# EAGLE design RPi-GPIO-V4 (EAGLE 6.4)
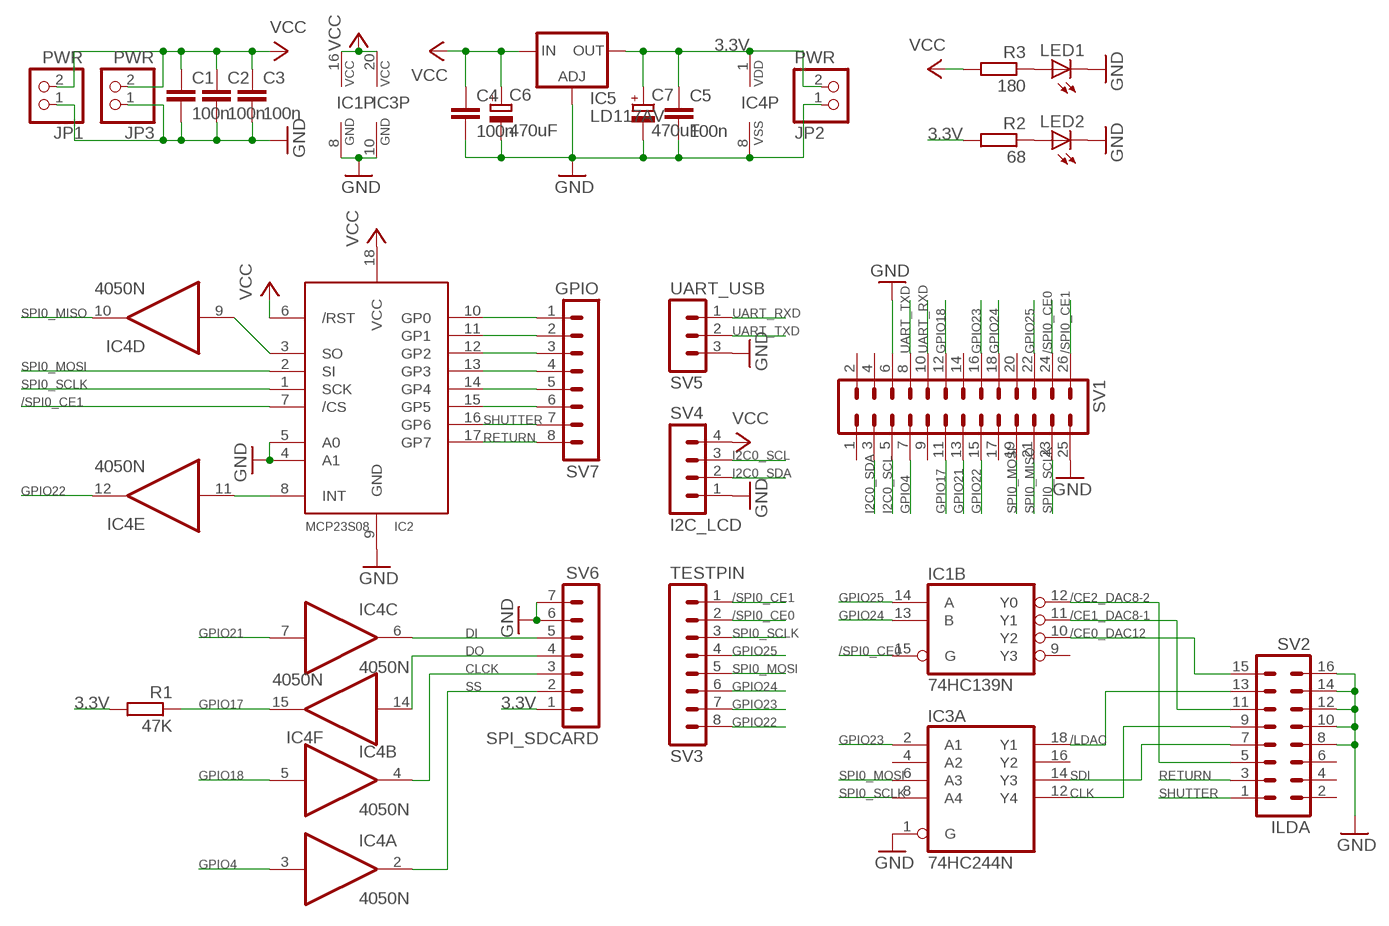
[diagram p0: schematic, sheet 1]

## Parts
C1  100n  C-EU050-024X044  [C050-024X044]
C2  100n  C-EU050-024X044  [C050-024X044]
C3  100n  C-EU050-024X044  [C050-024X044]
C4  100n  C-EU050-024X044  [C050-024X044]
C5  100n  C-EU050-024X044  [C050-024X044]
C6  470uF  CPOL-EUE5-8.5  [E5-8,5]
C7  470uF  CPOL-EUE5-8.5  [E5-8,5]
IC1  74HC139N  [DIL16]
IC2  MCP2300X/P  [DIL18]
IC3  74HC244N  [DIL20]
IC4  4050N  [DIL16]
IC5  LD117AV  [TO220L1]
JP1  PWR  PINHD-1X2  [1X02]
JP2  PWR  PINHD-1X2  [1X02]
JP3  PWR  PINHD-1X2  [1X02]
LED1  LED3MM  [LED3MM]
LED2  LED3MM  [LED3MM]
R1  47K  R-EU_0204/5  [0204/5]
R2  68  R-EU_0204/5  [0204/5]
R3  180  R-EU_0204/5  [0204/5]
SV1  MA13-2  [MA13-2]
SV2  ILDA  MA08-2  [MA08-2]
SV3  TESTPIN  MA08-1  [MA08-1]
SV4  I2C_LCD  MA04-1  [MA04-1]
SV5  UART_USB  MA03-1  [MA03-1]
SV6  SPI_SDCARD  MA07-1  [MA07-1]
SV7  GPIO  MA08-1  [MA08-1]

## Nets
3.3V: C5.1 C7.+ IC4.1(P:VDD) IC5.2(OUT) JP2.2 R1.2 R2.2 SV6.1
/CE0_DAC12: IC1.10(B:Y2) SV2.15
/CE1_DAC8-1: IC1.11(B:Y1) SV2.11
/CE2_DAC8-2: IC1.12(B:Y0) SV2.5
/LDAC: IC3.18(A:Y1) SV2.13
/SPI0_CE0: IC1.15(B:G) SV1.24 SV3.2
/SPI0_CE1: IC2.7(/CS) SV1.26 SV3.1
CLCK: IC4.4(B:O) SV6.3
CLK: IC3.12(A:Y4) SV2.9
DI: IC4.6(C:O) SV6.5
DO: IC4.14(F:I) SV6.4
GND: C1.2 C2.2 C3.2 C4.2 C5.2 C6.- C7.- IC1.8(P:GND) IC2.4(A1) IC2.5(A0) IC2.9(GND) IC3.1(A:G) IC3.10(P:GND) IC4.8(P:VSS) IC5.1(ADJ) JP1.1 JP2.1 JP3.1 LED1.K(C) LED2.K(C) SV1.6 SV1.25 SV2.8 SV2.10 SV2.12 SV2.14 SV2.16 SV4.1 SV5.3 SV6.6 SV6.7
GPIO4: IC4.3(A:I) SV1.7
GPIO17: IC4.15(F:O) R1.1 SV1.11
GPIO18: IC4.5(B:I) SV1.12
GPIO21: IC4.7(C:I) SV1.13
GPIO22: IC4.12(E:O) SV1.15 SV3.8
GPIO23: IC3.2(A:A1) SV1.16 SV3.7
GPIO24: IC1.13(B:B) SV1.18 SV3.6
GPIO25: IC1.14(B:A) SV1.22 SV3.4
I2C0_SCL: SV1.5 SV4.3
I2C0_SDA: SV1.3 SV4.2
N$1: LED1.A R3.1
N$3: LED2.A R2.1
N$7: IC2.3(SO) IC4.9(D:I)
N$13: IC2.10(GP0) SV7.1
N$14: IC2.11(GP1) SV7.2
N$15: IC2.12(GP2) SV7.3
N$16: IC2.13(GP3) SV7.4
N$17: IC2.14(GP4) SV7.5
N$18: IC2.15(GP5) SV7.6
N$19: IC2.8(INT) IC4.11(E:I)
RETURN: IC2.17(GP7) SV2.3 SV7.8
SDI: IC3.14(A:Y3) SV2.7
SHUTTER: IC2.16(GP6) SV2.1 SV7.7
SPI0_MISO: IC4.10(D:O) SV1.21
SPI0_MOSI: IC2.2(SI) IC3.6(A:A3) SV1.19 SV3.5
SPI0_SCLK: IC2.1(SCK) IC3.8(A:A4) SV1.23 SV3.3
SS: IC4.2(A:O) SV6.2
UART_RXD: SV1.10 SV5.1
UART_TXD: SV1.8 SV5.2
VCC: C1.1 C2.1 C3.1 C4.1 C6.+ IC1.16(P:VCC) IC2.6(/RST) IC2.18(VCC) IC3.20(P:VCC) IC5.3(IN) JP1.2 JP3.2 R3.2 SV4.4
Unconnected: IC1.1(A:G) IC1.2(A:A) IC1.3(A:B) IC1.4(A:Y0) IC1.5(A:Y1) IC1.6(A:Y2) IC1.7(A:Y3) IC1.9(B:Y3) IC3.3(B:Y4) IC3.4(A:A2) IC3.5(B:Y3) IC3.7(B:Y2) IC3.9(B:Y1) IC3.11(B:A1) IC3.13(B:A2) IC3.15(B:A3) IC3.16(A:Y2) IC3.17(B:A4) IC3.19(B:G) SV1.1 SV1.2 SV1.4 SV1.9 SV1.14 SV1.17 SV1.20 SV2.2 SV2.4 SV2.6

## Library data of the parts
C1-C5 = rcl:C-EU: CAPACITOR, European symbol
C6 C7 = rcl:CPOL-EU: POLARIZED CAPACITOR, European symbol
IC1 = 74xx-eu:74*139: Dual 2-line to 4-line DECODER/DEMULTIPLEXER
IC2 = adafruit:MCP2300X: MCP23S08 Inexpensive SPI i/o expander - 8 general purpose i/o pins with optional pullups
IC3 = 74xx-eu:74*244: Octal BUFFER and LINE DRIVER, 3-state
IC4 = 40xx:4050: Hex non-inverting BUFFER
IC5 = v-reg:LD117A?*: Low drop fixed and adjustable positive voltage regulators 1 A Source: http://www.st.com/stonline/products/literature/ds/7194/ld1117axx.pdf
JP1-JP3 = pinhead:PINHD-1X2: PIN HEADER
LED1 LED2 = led:LED: LED OSRAM: - CHIPLED LG R971, LG N971, LY N971, LG Q971, LY Q971, LO R971, LY R971 LH N974, LH R974 LS Q976, LO Q976, LY Q976 LO Q996 - Hyper CHIPLED LW Q18S LB Q993, LB Q99A, LB R99A - SideLED LS A670, LO A670, LY A670, LG A670, LP A670 LB A673, LV A673, LT A673, LW A673 LH A674 LY A675 LS A676, LA A676, LO A676, LY A676, LW A676 LS A679, LY A679, LG A679 - Hyper Micro SIDELED® LS Y876, LA Y876, LO Y876, LY Y876 LT Y87S - SmartLED LW L88C, LW L88S LB L89C, LB L89S, LG L890 LS L89K, LO L89K, LY L89K LS L896, LA L896, LO L896, LY L896 - TOPLED LS T670, LO T670, LY T670, LG T670, LP T670 LSG T670, LSP T670, LSY T670, LOP T670, LYG T670 LG T671, LOG T671, LSG T671 LB T673, LV T673, LT T673, LW T673 LH T674 LS T676, LA T676, LO T676, LY T676, LB T676, LH T676, LSB T676, LW T676 LB T67C, LV T67C, LT T67C, LS T67K, LO T67K, LY T67K, LW E67C LS E67B, LA E67B, LO E67B, LY E67B, LB E67C, LV E67C, LT E67C LW T67C LS T679, LY T679, LG T679 LS T770, LO T770, LY T770, LG T770, LP T770 LB T773, LV T773, LT T773, LW T773 LH T774 LS E675, LA E675, LY E675, LS T675 LS T776, LA T776, LO T776, LY T776, LB T776 LHGB T686 LT T68C, LB T68C - Hyper Mini TOPLED® LB M676 - Mini TOPLED Santana® LG M470 LS M47K, LO M47K, LY M47K Source: http://www.osram.convergy.de LUXEON: - LUMILED® LXK2-PW12-R00, LXK2-PW12-S00, LXK2-PW14-U00, LXK2-PW14-V00 LXK2-PM12-R00, LXK2-PM12-S00, LXK2-PM14-U00 LXK2-PE12-Q00, LXK2-PE12-R00, LXK2-PE12-S00, LXK2-PE14-T00, LXK2-PE14-U00 LXK2-PB12-K00, LXK2-PB12-L00, LXK2-PB12-M00, LXK2-PB14-N00, LXK2-PB14-P00, LXK2-PB14-Q00 LXK2-PR12-L00, LXK2-PR12-M00, LXK2-PR14-Q00, LXK2-PR14-R00 LXK2-PD12-Q00, LXK2-PD12-R00, LXK2-PD12-S00 LXK2-PH12-R00, LXK2-PH12-S00 LXK2-PL12-P00, LXK2-PL12-Q00, LXK2-PL12-R00 Source: www.luxeon.com KINGBRIGHT: KA-3528ASYC Source: www.kingbright.com
R1-R3 = resistor:R-EU_: RESISTOR, European symbol
SV1 = con-lstb:MA13-2: PIN HEADER; OC_FARNELL: unknown; OC_NEWARK: unknown
SV2 = con-lstb:MA08-2: PIN HEADER; OC_FARNELL: unknown; OC_NEWARK: unknown
SV3 SV7 = con-lstb:MA08-1: PIN HEADER; OC_FARNELL: unknown; OC_NEWARK: unknown
SV4 = con-lstb:MA04-1: PIN HEADER; OC_FARNELL: unknown; OC_NEWARK: unknown
SV5 = con-lstb:MA03-1: PIN HEADER; OC_FARNELL: unknown; OC_NEWARK: unknown
SV6 = con-lstb:MA07-1: PIN HEADER; OC_FARNELL: unknown; OC_NEWARK: unknown

## Board
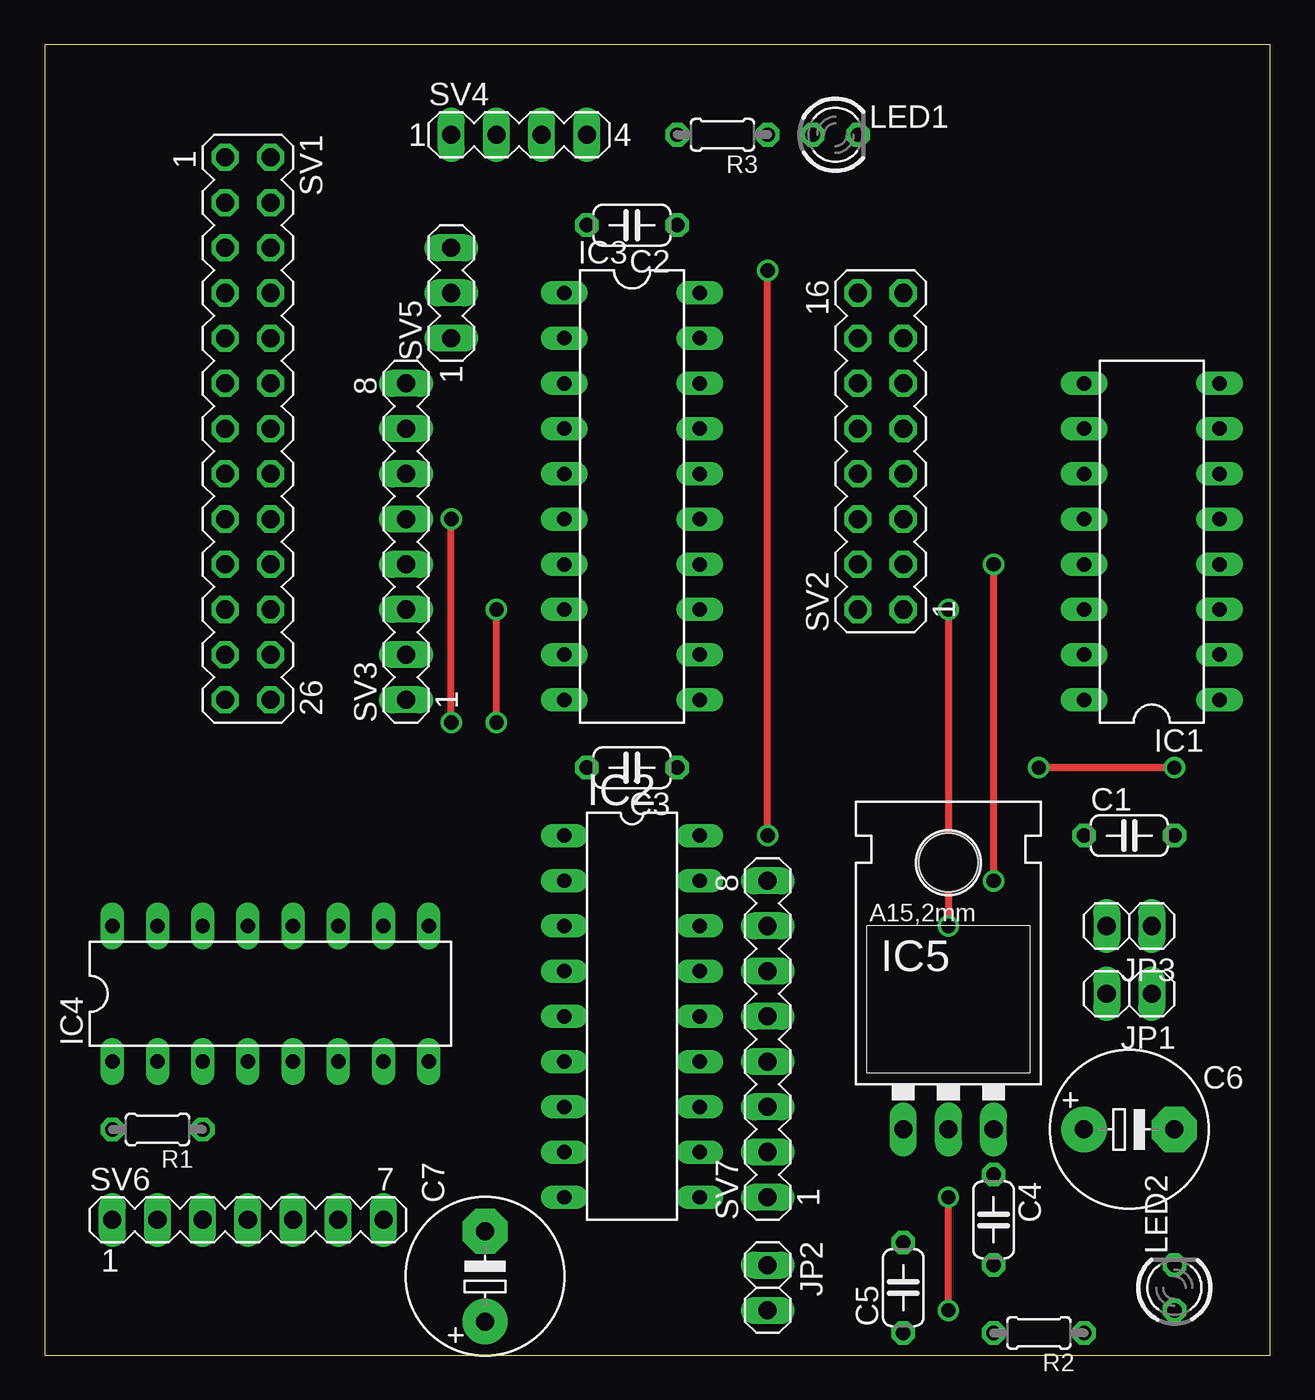
[diagram p1: board, top side]
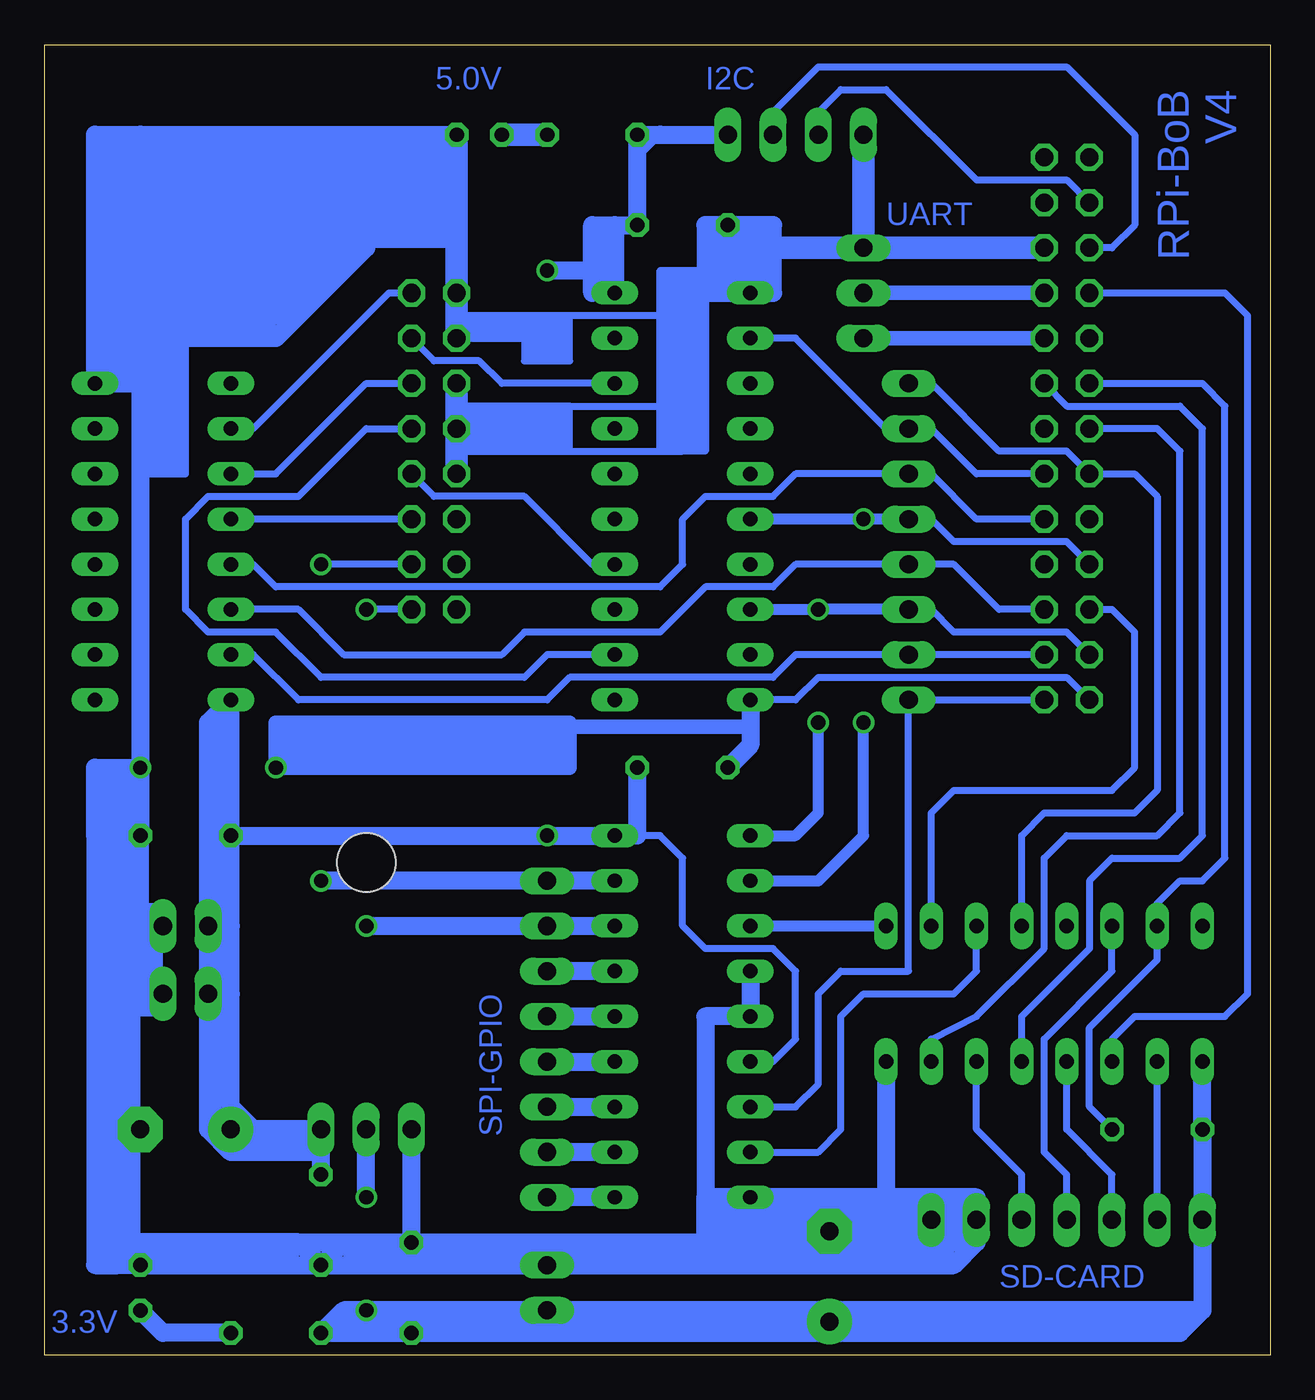
[diagram p2: board, bottom side, seen from below]

Size 68.88 x 73.65 mm. Coordinates in mm from the lower left corner, seen from the top.
Outline: 0,0 68.88,0 68.88,73.65 0,73.65 0,0
Copper layers (1*16): Top 0.035mm / dielectric 1.5mm / Bottom 0.035mm
Design rules "default": minimum track width 10mil, minimum drill 24mil, track to track 8mil, track to pad 8mil, pad to pad 8mil, via to via 8mil, smd to smd 8mil, copper to edge 40mil, drill to drill 8mil, minimum pad ring 10mil, minimum via ring 8mil, stop-mask expansion 4mil, vias tented up to drill 0mil, thermal gap 10mil

### Footprints (pad centres in the part's own frame; a part is rotated, then mirrored left to right if it is on the bottom)
C050-024X044 = drill 0.813 octagon: 1 -2.54,0; 2 2.54,0
E5-8,5 = drill 1.016 pad 2.54: + -2.54,0 | drill 1.016 pad 2.54 octagon: - 2.54,0
DIL16 = drill 0.813 long: 1 -8.89,-3.81; 2 -6.35,-3.81; 3 -3.81,-3.81; 4 -1.27,-3.81; 5 1.27,-3.81; 6 3.81,-3.81; 7 6.35,-3.81; 8 8.89,-3.81; 9 8.89,3.81; 10 6.35,3.81; 11 3.81,3.81; 12 1.27,3.81; 13 -1.27,3.81; 14 -3.81,3.81; 15 -6.35,3.81; 16 -8.89,3.81
DIL18 = drill 0.813 long: 1 -10.16,-3.81; 2 -7.62,-3.81; 3 -5.08,-3.81; 4 -2.54,-3.81; 5 0,-3.81; 6 2.54,-3.81; 7 5.08,-3.81; 8 7.62,-3.81; 9 10.16,-3.81; 10 10.16,3.81; 11 7.62,3.81; 12 5.08,3.81; 13 2.54,3.81; 14 0,3.81; 15 -2.54,3.81; 16 -5.08,3.81; 17 -7.62,3.81; 18 -10.16,3.81
DIL20 = drill 0.813 long: 1 -11.43,-3.81; 2 -8.89,-3.81; 3 -6.35,-3.81; 4 -3.81,-3.81; 5 -1.27,-3.81; 6 1.27,-3.81; 7 3.81,-3.81; 8 6.35,-3.81; 9 8.89,-3.81; 10 11.43,-3.81; 11 11.43,3.81; 12 8.89,3.81; 13 6.35,3.81; 14 3.81,3.81; 15 1.27,3.81; 16 -1.27,3.81; 17 -3.81,3.81; 18 -6.35,3.81; 19 -8.89,3.81; 20 -11.43,3.81
TO220L1 = drill 1.016 long: 1 -2.54,-3.81; 2 0,-3.81; 3 2.54,-3.81 | hole 3.302: 0,11.176
1X02 = drill 1.016 long: 1 -1.27,0; 2 1.27,0
LED3MM = drill 0.813 octagon: A -1.27,0; K 1.27,0
0204/5 = drill 0.813 octagon: 1 -2.54,0; 2 2.54,0
MA13-2 = drill 1.016 octagon: 1 -15.24,-1.27; 2 -15.24,1.27; 3 -12.7,-1.27; 4 -12.7,1.27; 5 -10.16,-1.27; 6 -10.16,1.27; 7 -7.62,-1.27; 8 -7.62,1.27; 9 -5.08,-1.27; 10 -5.08,1.27; 11 -2.54,-1.27; 12 -2.54,1.27; 13 0,-1.27; 14 0,1.27; 15 2.54,-1.27; 16 2.54,1.27; 17 5.08,-1.27; 18 5.08,1.27; 19 7.62,-1.27; 20 7.62,1.27; 21 10.16,-1.27; 22 10.16,1.27; 23 12.7,-1.27; 24 12.7,1.27; 25 15.24,-1.27; 26 15.24,1.27
MA08-2 = drill 1.016 octagon: 1 -8.89,-1.27; 2 -8.89,1.27; 3 -6.35,-1.27; 4 -6.35,1.27; 5 -3.81,-1.27; 6 -3.81,1.27; 7 -1.27,-1.27; 8 -1.27,1.27; 9 1.27,-1.27; 10 1.27,1.27; 11 3.81,-1.27; 12 3.81,1.27; 13 6.35,-1.27; 14 6.35,1.27; 15 8.89,-1.27; 16 8.89,1.27
MA08-1 = drill 1.016 long: 1 -8.89,0; 2 -6.35,0; 3 -3.81,0; 4 -1.27,0; 5 1.27,0; 6 3.81,0; 7 6.35,0; 8 8.89,0
MA04-1 = drill 1.016 long: 1 -3.81,0; 2 -1.27,0; 3 1.27,0; 4 3.81,0
MA03-1 = drill 1.016 long: 1 -2.54,0; 2 0,0; 3 2.54,0
MA07-1 = drill 1.016 long: 1 -7.62,0; 2 -5.08,0; 3 -2.54,0; 4 0,0; 5 2.54,0; 6 5.08,0; 7 7.62,0

### Placement (x,y rotation side)
C1  60.96,29.21 0 top
C2  33.02,63.5 180 top
C3  33.02,33.02 180 top
C4  53.34,7.62 270 top
C5  48.26,3.81 90 top
C6  60.96,12.7 0 top
C7  24.77,4.45 90 top
IC1  62.23,45.72 90 top
IC2  33.02,19.05 270 top
IC3  33.02,48.26 270 top
IC4  12.7,20.32 0 top
IC5  50.8,16.51 0 top
JP1  60.96,20.32 180 top
JP2  40.64,3.81 270 top
JP3  60.96,24.13 180 top
LED1  44.45,68.58 0 top
LED2  63.5,3.81 90 top
R1  6.35,12.7 180 top
R2  55.88,1.27 180 top
R3  38.1,68.58 180 top
SV1  11.43,52.07 270 top
SV2  46.99,50.8 90 top
SV3  20.32,45.72 90 top
SV4  26.67,68.58 0 top
SV5  22.86,59.69 90 top
SV6  11.43,7.62 0 top
SV7  40.64,17.78 90 top

### Tracks (layer width: path | path; a pad name or v marks a point on that pad's centre or on a via)
3.3V  (via drill 0.8)
  Top 0.406: v50.8,2.54 v50.8,8.89
  Bottom 1.016: IC4.1 R1.2 SV6.1 3.81,2.54 | v50.8,8.89 IC5.2 | R2.2 v50.8,2.54 C5.1 | C5.1 40.64,1.27 | JP2.2 40.64,1.27 | 40.64,1.27 5.08,1.27 3.81,2.54 | R2.2 52.07,2.54 | 52.07,2.54 C7.+ 3.81,2.54 | R2.2 C5.1 | 3.81,2.54 52.07,2.54
/CE0_DAC12
  Bottom 0.406: IC1.10 57.15,52.07 49.53,59.69 SV2.15
/CE1_DAC8-1
  Bottom 0.406: IC1.11 55.88,49.53 50.8,54.61 SV2.11
/CE2_DAC8-2
  Bottom 0.406: SV2.5 IC1.12
/LDAC
  Bottom 0.406: IC3.18 43.18,54.61 44.45,55.88 46.99,55.88 SV2.13
/SPI0_CE0
  Bottom 0.406: SV1.24 SV3.2 26.67,39.37 27.94,38.1 39.37,38.1 40.64,36.83 54.61,36.83 57.15,39.37 IC1.15
/SPI0_CE1
  Bottom 0.406: SV1.26 SV3.1 20.32,21.59 24.13,21.59 25.4,20.32 25.4,15.24 26.67,13.97 IC2.7
CLCK
  Bottom 0.406: SV6.3 8.89,10.16 11.43,12.7 IC4.4 11.43,15.24
CLK
  Bottom 0.406: IC3.12 40.64,39.37 41.91,38.1 53.34,38.1 55.88,40.64 59.69,40.64 60.96,41.91 60.96,46.99 59.69,48.26 54.61,48.26 50.8,52.07 SV2.9
DI
  Bottom 0.406: 16.51,15.24 IC4.6 16.51,12.7 13.97,10.16 SV6.5
DO
  Bottom 0.406: SV6.4 11.43,10.16 12.7,11.43 12.7,17.78 8.89,21.59 IC4.14
GND  (via drill 0.8)
  Top 0.406: v63.5,33.02 v55.88,33.02
  Bottom 0.406: 33.02,58.42 33.02,59.69 31.75,59.69 | 31.75,59.69 IC3.1 | IC3.1 29.21,62.23 29.21,63.5 C2.2 | 39.37,50.8 34.29,50.8 | 34.29,50.8 33.02,50.8 | 33.02,50.8 33.02,53.34 | 33.02,53.34 33.02,58.42 | SV1.25 11.43,38.1 25.4,38.1 26.67,36.83 IC3.10 | 27.94,59.69 IC3.1 | 31.75,59.69 31.75,50.8 33.02,50.8 | 34.29,50.8 34.29,60.96 31.75,60.96 31.75,63.5 | 33.02,58.42 39.37,58.42 | 39.37,58.42 45.72,58.42 | 39.37,53.34 33.02,53.34 | SV2.14 41.91,57.15 41.91,55.88 39.37,55.88 39.37,58.42 | 45.72,50.8 39.37,50.8 | 39.37,50.8 39.37,53.34 | 39.37,53.34 45.72,53.34 | 63.5,49.53 60.96,49.53 60.96,57.15 60.96,62.23 | 39.37,35.56 29.21,35.56 | C6.- 64.77,12.7 | C7.- SV6.7
  Bottom 0.813: 39.37,33.02 v55.88,33.02 55.88,35.56 39.37,35.56 39.37,33.02
  Bottom 1.016: 63.5,20.32 63.5,24.13 C1.2 | 63.5,54.61 63.5,49.53 v63.5,33.02 | 63.5,68.58 LED1.K | 63.5,54.61 IC1.8 66.04,68.58 63.5,68.58 | 63.5,54.61 63.5,68.58 | C5.2 IC5.1 | 29.21,6.35 29.21,7.62 | IC2.9 31.75,8.89 | SV6.6 SV6.7 21.59,7.62 | IC4.8 21.59,7.62 | 21.59,7.62 C7.- 29.21,7.62 | 64.77,5.08 64.77,6.35 | 64.77,6.35 64.77,12.7 64.77,29.21 C1.2 | 50.8,62.23 55.88,57.15 60.96,57.15 | 29.21,6.35 16.51,6.35 | 16.51,6.35 16.51,8.89 IC2.9 | IC2.9 29.21,7.62 | IC2.4 IC2.5 31.75,19.05 31.75,8.89 | IC3.10 29.21,35.56 29.21,34.29 C3.2 | C1.2 66.04,29.21 | 66.04,29.21 66.04,5.08 64.77,5.08 | LED2.K 64.77,5.08 | 66.04,29.21 66.04,33.02 v63.5,33.02 | v63.5,33.02 C1.2 | C4.2 52.07,6.35 | 52.07,6.35 C5.2 | C5.2 40.64,6.35 | 40.64,6.35 31.75,6.35 | 31.75,6.35 29.21,6.35 | JP2.1 40.64,6.35 | LED2.K C4.2 | C4.2 54.61,6.35 | 54.61,6.35 64.77,6.35 | LED2.K 17.78,5.08 16.51,6.35 | 54.61,6.35 52.07,6.35 | 31.75,6.35 31.75,8.89 | 27.94,59.69 27.94,63.5 31.75,63.5 31.75,59.69 27.94,59.69
  Bottom 1.27: SV5.3 SV1.6 | SV2.14 45.72,58.42 SV2.16 LED1.K | SV2.12 45.72,53.34 SV2.10 45.72,50.8 SV2.8 | SV5.3 29.21,62.23 | JP3.1 63.5,24.13 | JP1.1 63.5,20.32 | SV5.3 SV4.1
GPIO4
  Bottom 0.406: SV1.7 2.54,59.69 1.27,58.42 1.27,20.32 2.54,19.05 7.62,19.05 8.89,17.78 IC4.3
GPIO17
  Bottom 0.406: SV1.11 3.81,54.61 2.54,53.34 2.54,27.94 3.81,26.67 5.08,26.67 6.35,25.4 IC4.15 6.35,22.23 10.16,18.41 10.16,13.97 R1.1
GPIO18
  Bottom 0.406: SV1.12 11.43,53.34 5.08,53.34 3.81,52.07 3.81,29.21 5.08,27.94 8.89,27.94 10.16,26.67 10.16,22.86 13.97,19.05 IC4.5
GPIO21
  Bottom 0.406: SV1.13 6.35,52.07 5.08,50.8 5.08,30.48 6.35,29.21 11.43,29.21 12.7,27.94 12.7,22.86 16.51,19.05 19.05,17.78 IC4.7
GPIO22
  Bottom 0.406: SV3.8 19.05,54.61 15.24,50.8 11.43,50.8 SV1.15 7.62,49.53 6.35,48.26 6.35,31.75 7.62,30.48 12.7,30.48 13.97,29.21 IC4.12
GPIO23
  Bottom 0.406: SV1.16 16.51,49.53 19.05,52.07 SV3.7 21.59,52.07 26.67,57.15 IC3.2
GPIO24
  Bottom 0.406: SV1.18 16.51,46.99 19.05,49.53 SV3.6 26.67,49.53 27.94,48.26 31.75,48.26 33.02,46.99 33.02,44.45 34.29,43.18 55.88,43.18 57.15,44.45 IC1.13
GPIO25
  Bottom 0.406: SV1.22 15.24,41.91 17.78,44.45 SV3.4 26.67,44.45 27.94,43.18 31.75,43.18 34.29,40.64 41.91,40.64 43.18,39.37 52.07,39.37 54.61,41.91 IC1.14
I2C0_SCL
  Bottom 0.406: SV4.3 27.94,69.85 25.4,72.39 11.43,72.39 7.62,68.58 7.62,63.5 8.89,62.23 SV1.5
I2C0_SDA
  Bottom 0.406: SV1.3 11.43,66.04 16.51,66.04 21.59,71.12 24.13,71.12 25.4,69.85 SV4.2
N$1
  Bottom 1.27: LED1.A R3.1
N$3
  Bottom 1.016: R2.1 62.23,1.27 LED2.A
N$5
  Bottom 1.016: 52.07,63.5 52.07,62.23 55.88,58.42 55.88,59.69 52.07,63.5
N$7
  Bottom 0.61: IC2.3 IC4.9
N$13
  Bottom 1.016: IC2.10 SV7.1
N$14
  Bottom 1.016: IC2.11 SV7.2
N$15
  Bottom 1.016: SV7.3 IC2.12
N$16
  Bottom 1.016: SV7.4 IC2.13
N$17
  Bottom 1.016: SV7.5 IC2.14
N$18
  Bottom 1.016: IC2.15 SV7.6
N$19
  Bottom 0.406: IC4.11 16.51,21.59 17.78,20.32 22.86,20.32 24.13,19.05 24.13,12.7 25.4,11.43 IC2.8
RETURN  (via drill 0.8)
  Top 0.406: v53.34,44.45 v53.34,26.67
  Bottom 0.406: SV2.3 v53.34,44.45
  Bottom 1.016: IC2.17 SV7.8 v53.34,26.67
SDI
  Bottom 0.406: IC3.14 38.1,44.45 41.91,48.26 46.99,48.26 SV2.7
SHUTTER  (via drill 0.8)
  Top 0.406: v50.8,41.91 v50.8,24.13
  Bottom 0.406: SV2.1 v50.8,41.91
  Bottom 1.016: IC2.16 SV7.7 v50.8,24.13
SPI0_MISO
  Bottom 0.406: SV1.21 8.89,41.91 7.62,40.64 7.62,33.02 8.89,31.75 17.78,31.75 19.05,30.48 IC4.10
SPI0_MOSI  (via drill 0.8)
  Top 0.406: v22.86,35.56 v22.86,46.99
  Bottom 0.406: SV1.19 11.43,45.72 17.78,45.72 19.05,46.99 SV3.5
  Bottom 0.61: SV3.5 v22.86,46.99 IC3.6 | IC2.2 25.4,26.67 22.86,29.21 v22.86,35.56
SPI0_SCLK  (via drill 0.8)
  Top 0.406: v25.4,35.56 v25.4,41.91
  Bottom 0.406: SV1.23 11.43,40.64 17.78,40.64 19.05,41.91 SV3.3
  Bottom 0.61: SV3.3 v25.4,41.91 IC3.8 | IC2.1 26.67,29.21 25.4,30.48 v25.4,35.56
SS
  Bottom 0.406: SV6.2 IC4.2
UART_RXD
  Bottom 0.813: SV1.10 SV5.1
UART_TXD
  Bottom 0.813: SV1.8 SV5.2
VCC  (via drill 0.8)
  Top 0.406: v40.64,29.21 v40.64,60.96
  Bottom 0.406: IC2.6 27.94,16.51 26.67,17.78 26.67,21.59 27.94,22.86 31.75,22.86 33.02,24.13 33.02,27.94 34.29,29.21 IC2.18 | C1.1 C6.+ | 35.56,67.31 34.29,68.58
  Bottom 1.016: v40.64,29.21 IC2.18 | JP3.2 58.42,24.13 | IC3.20 36.83,60.96 v40.64,60.96 | JP1.2 58.42,20.32 | 58.42,20.32 58.42,24.13 | 58.42,24.13 C1.1 | C4.1 53.34,11.43 | 53.34,11.43 IC5.3 | C1.1 IC1.16 59.69,35.56 59.69,13.97 | C1.1 IC2.18 | SV4.4 34.29,68.58 R3.2 35.56,67.31 C2.1 36.83,63.5 | 36.83,63.5 IC3.20 | IC3.20 38.1,59.69 38.1,63.5 36.83,63.5 | IC5.3 57.15,12.7 58.42,13.97 58.42,20.32 | IC2.18 35.56,29.21 C3.1 | IC5.3 C6.+ 59.69,13.97 | 53.34,11.43 58.42,11.43 59.69,12.7 59.69,13.97
(copper drawn outside any net)
  shapes: Bottom area x33

### Text on the board
Bottom: 5.0V | RPi-BoB / V4 | I2C | UART | SPI-GPIO | SD-CARD | 3.3V